# EasyEDA schematic Computer.json
TITLE: Common Register; REV: 1.0; Date: 2026-07-08; Sheet: 1/1; Company: Your Company
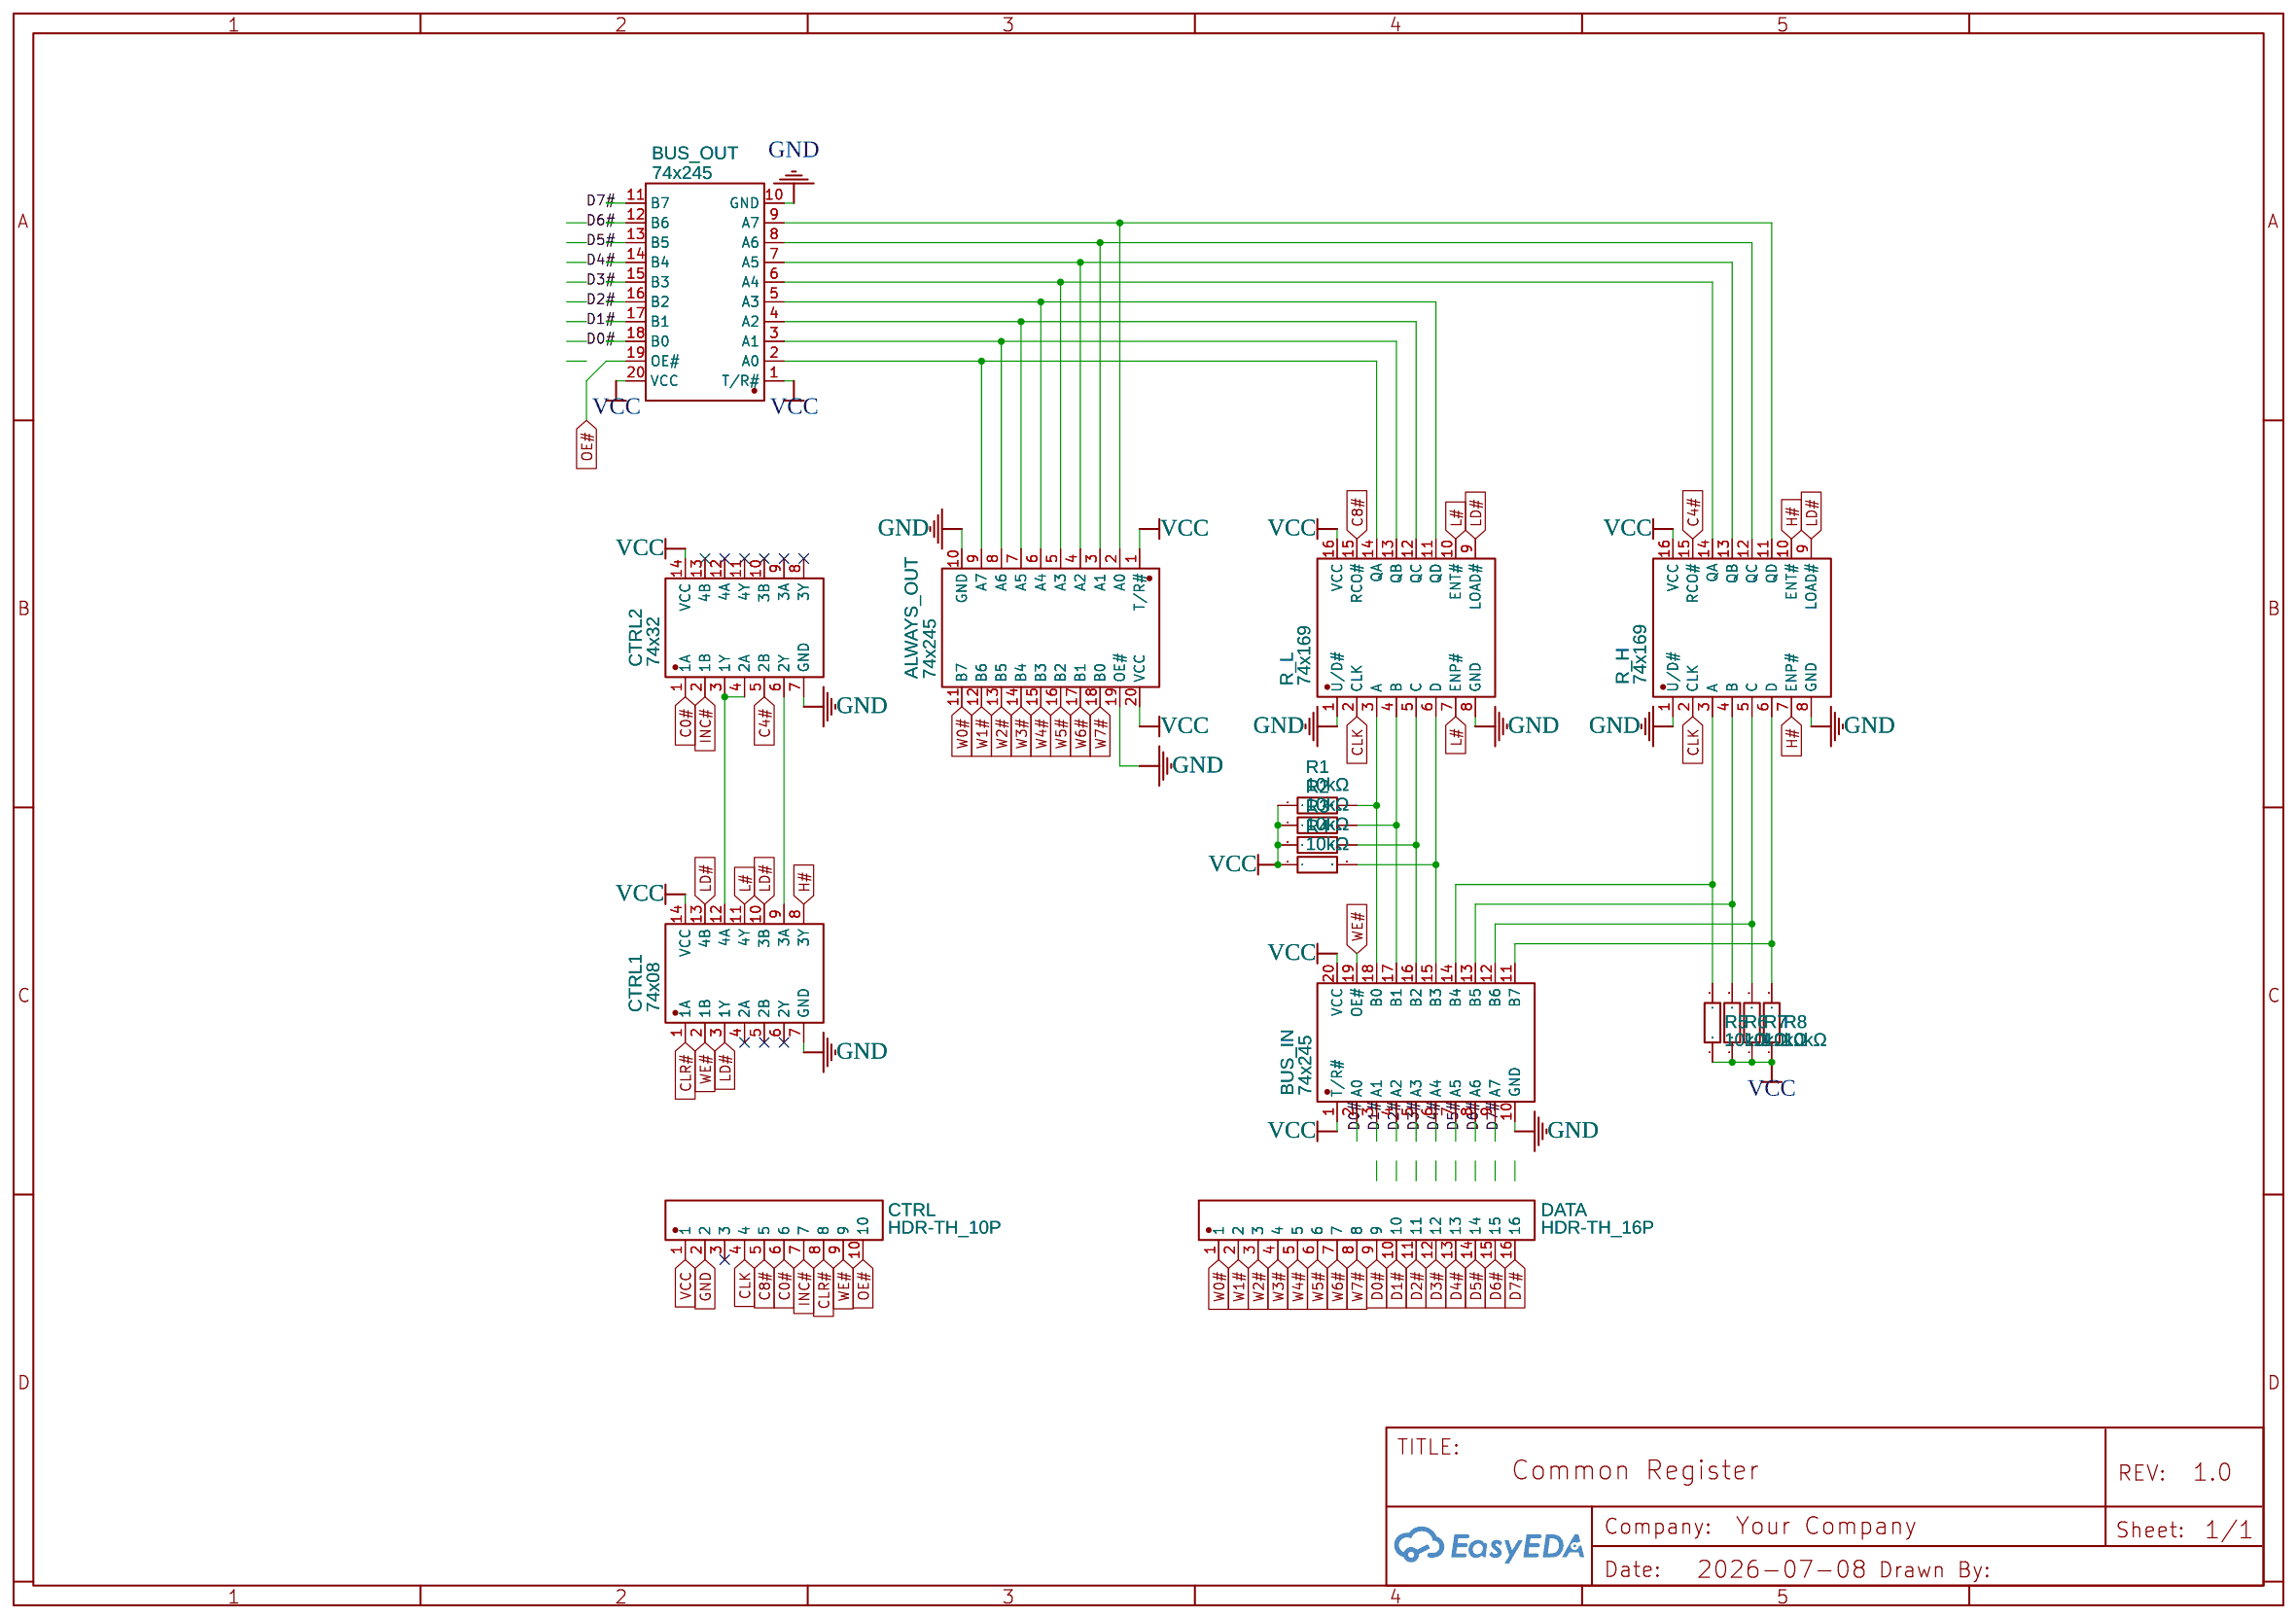
[diagram p0: schematic sheet]

## Parts
ALWAYS_OUT  74x245  [PDIP-20_L24.5-W6.4-P2.54-LS7.9-BL]
BUS_IN  74x245  [PDIP-20_L24.5-W6.4-P2.54-LS7.9-BL]
BUS_OUT  74x245  [PDIP-20_L24.5-W6.4-P2.54-LS7.9-BL]
CTRL  HDR-TH_10P  [HDR-TH_10P-P2.54_B25410120-10PB0513-H25A60]
CTRL1  74x08  [PDIP-14_L19.6-W6.5-P2.54-LS7.9-BL]
CTRL2  74x32  [PDIP-14_L19.6-W6.5-P2.54-LS7.9-BL]
DATA  HDR-TH_16P  [HDR-TH_16P-P2.54_B25420220-16PB0513-H85C32]
R1  10kΩ  [RES-TH_BD2.3-L6.5-P10.50-D0.5]
R2  10kΩ  [RES-TH_BD2.3-L6.5-P10.50-D0.5]
R3  10kΩ  [RES-TH_BD2.3-L6.5-P10.50-D0.5]
R4  10kΩ  [RES-TH_BD2.3-L6.5-P10.50-D0.5]
R5  10kΩ  [RES-TH_BD2.3-L6.5-P10.50-D0.5]
R6  10kΩ  [RES-TH_BD2.3-L6.5-P10.50-D0.5]
R7  10kΩ  [RES-TH_BD2.3-L6.5-P10.50-D0.5]
R8  10kΩ  [RES-TH_BD2.3-L6.5-P10.50-D0.5]
R_H  74x169  [PDIP-16_L19.6-W6.5-P2.54-LS7.9-BL]
R_L  74x169  [PDIP-16_L19.6-W6.5-P2.54-LS7.9-BL]

## Library data of the parts
ALWAYS_OUT BUS_IN BUS_OUT = DM74LS245N: Contributor: lcsc; Supplier: LCSC; Supplier Part: C3587235; Manufacturer: onsemi(安森美); JLCPCB Part Class: Extended Part
CTRL = B25410120-10PB0513-H25A60: Supplier: LCSC; Supplier Part: C42385486; Manufacturer: HMTCONN(华明通); JLCPCB Part Class: Extended Part; Contributor: lcsc
CTRL1 = SN74LS08N: Contributor: LCSC; Supplier: LCSC; Supplier Part: C2869595; Manufacturer: TI(德州仪器); JLCPCB Part Class: Extended Part
CTRL2 = SN74LS32N: Contributor: LCSC; Supplier: LCSC; Supplier Part: C273644; Manufacturer: TI(德州仪器); JLCPCB Part Class: Extended Part
DATA = ZX-PZ1.27-1-16PZZ: Supplier: LCSC; Supplier Part: C41370748; Manufacturer: Megastar(兆星); Contributor: lcsc
R1-R8 = MF1/4W-10KΩ±1% T52: Contributor: LCSC; Supplier: LCSC; Supplier Part: C119347; Manufacturer: CCO(千志电子); Manufacturer Part: MF1/4W-10KΩ±1% T; JLCPCB Part Class: Extended Part
R_H R_L = SN74LS169BN: Contributor: LCSC; Supplier: LCSC; Supplier Part: C1548008; Manufacturer: TI(德州仪器); JLCPCB Part Class: Extended Part

## Nets
GND: ALWAYS_OUT.10(GND) ALWAYS_OUT.19(OE#) BUS_IN.10(GND) BUS_OUT.10(GND) CTRL.2 CTRL1.7(GND) CTRL2.7(GND) R_H.1(U/D#) R_H.8(GND) R_L.1(U/D#) R_L.8(GND)
VCC: ALWAYS_OUT.1(T/R#) ALWAYS_OUT.20(VCC) BUS_IN.1(T/R#) BUS_IN.20(VCC) BUS_OUT.1(T/R#) BUS_OUT.20(VCC) CTRL.1 CTRL1.14(VCC) CTRL2.14(VCC) R1.1 R2.1 R3.1 R4.1 R5.1 R6.1 R7.1 R8.1 R_H.16(VCC) R_L.16(VCC)
C0#: CTRL.6 CTRL2.1(1A)
C4#: CTRL2.5(2B) R_H.15(RCO#)
C8#: CTRL.5 R_L.15(RCO#)
CLK: CTRL.4 R_H.2(CLK) R_L.2(CLK)
CLR#: CTRL.8 CTRL1.1(1A)
D0#: BUS_IN.2(A0) BUS_OUT.18(B0) DATA.9
D1#: BUS_IN.3(A1) BUS_OUT.17(B1) DATA.10
D2#: BUS_IN.4(A2) BUS_OUT.16(B2) DATA.11
D3#: BUS_IN.5(A3) BUS_OUT.15(B3) DATA.12
D4#: BUS_IN.6(A4) BUS_OUT.14(B4) DATA.13
D5#: BUS_IN.7(A5) BUS_OUT.13(B5) DATA.14
D6#: BUS_IN.8(A6) BUS_OUT.12(B6) DATA.15
D7#: BUS_IN.9(A7) BUS_OUT.11(B7) DATA.16
H#: CTRL1.8(3Y) R_H.7(ENP#) R_H.10(ENT#)
INC#: CTRL.7 CTRL2.2(1B)
L#: CTRL1.11(4Y) R_L.7(ENP#) R_L.10(ENT#)
LD#: CTRL1.3(1Y) CTRL1.10(3B) CTRL1.13(4B) R_H.9(LOAD#) R_L.9(LOAD#)
OE#: BUS_OUT.19(OE#) CTRL.10
W0#: ALWAYS_OUT.11(B7) DATA.1
W1#: ALWAYS_OUT.12(B6) DATA.2
W2#: ALWAYS_OUT.13(B5) DATA.3
W3#: ALWAYS_OUT.14(B4) DATA.4
W4#: ALWAYS_OUT.15(B3) DATA.5
W5#: ALWAYS_OUT.16(B2) DATA.6
W6#: ALWAYS_OUT.17(B1) DATA.7
W7#: ALWAYS_OUT.18(B0) DATA.8
WE#: BUS_IN.19(OE#) CTRL.9 CTRL1.2(1B)
Net-(ALWAYS_OUT-2): ALWAYS_OUT.2(A0) BUS_OUT.9(A7) R_H.11(QD)
Net-(ALWAYS_OUT-3): ALWAYS_OUT.3(A1) BUS_OUT.8(A6) R_H.12(QC)
Net-(ALWAYS_OUT-4): ALWAYS_OUT.4(A2) BUS_OUT.7(A5) R_H.13(QB)
Net-(ALWAYS_OUT-5): ALWAYS_OUT.5(A3) BUS_OUT.6(A4) R_H.14(QA)
Net-(ALWAYS_OUT-6): ALWAYS_OUT.6(A4) BUS_OUT.5(A3) R_L.11(QD)
Net-(ALWAYS_OUT-7): ALWAYS_OUT.7(A5) BUS_OUT.4(A2) R_L.12(QC)
Net-(ALWAYS_OUT-8): ALWAYS_OUT.8(A6) BUS_OUT.3(A1) R_L.13(QB)
Net-(ALWAYS_OUT-9): ALWAYS_OUT.9(A7) BUS_OUT.2(A0) R_L.14(QA)
Net-(BUS_IN-11): BUS_IN.11(B7) R8.2 R_H.6(D)
Net-(BUS_IN-12): BUS_IN.12(B6) R7.2 R_H.5(C)
Net-(BUS_IN-13): BUS_IN.13(B5) R6.2 R_H.4(B)
Net-(BUS_IN-14): BUS_IN.14(B4) R5.2 R_H.3(A)
Net-(BUS_IN-15): BUS_IN.15(B3) R4.2 R_L.6(D)
Net-(BUS_IN-16): BUS_IN.16(B2) R3.2 R_L.5(C)
Net-(BUS_IN-17): BUS_IN.17(B1) R2.2 R_L.4(B)
Net-(BUS_IN-18): BUS_IN.18(B0) R1.2 R_L.3(A)
Net-(CTRL1-9): CTRL1.9(3A) CTRL2.6(2Y)
Net-(CTRL1-12): CTRL1.12(4A) CTRL2.3(1Y) CTRL2.4(2A)

Not connected (* = marked no-connect by the designer): CTRL 3*; CTRL1 4(2A)* 5(2B)* 6(2Y)*; CTRL2 8(3Y)* 9(3A)* 10(3B)* 11(4Y)* 12(4A)* 13(4B)*
